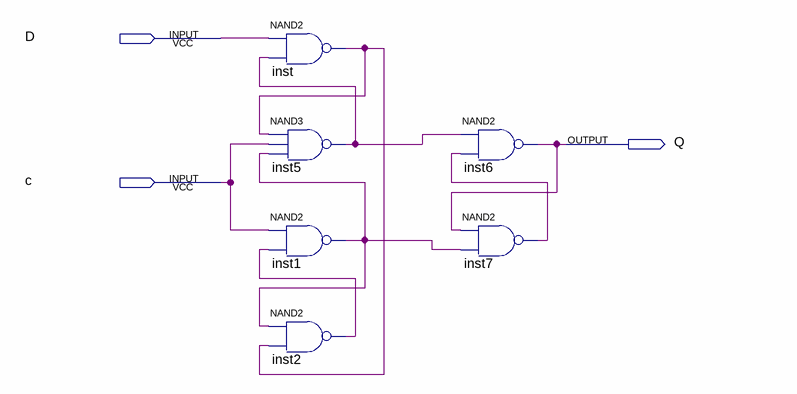
[diagram p0: schematic sheet]
// Quartus schematic flip_flop_D_edge.bdf as structural Verilog: 6 symbols, 3 pins
module flip_flop_D_edge (
  input  D,
  input  c,
  output Q
);

  wire inst1_out, inst2_out, inst5_out, inst7_out, inst_out;

  nand inst (inst_out, D, inst5_out);
  nand inst5 (inst5_out, inst_out, c, inst1_out);
  nand inst1 (inst1_out, c, inst2_out);
  nand inst2 (inst2_out, inst1_out, inst_out);
  nand inst6 (Q, inst5_out, inst7_out);
  nand inst7 (inst7_out, Q, inst1_out);
endmodule
